# Altium schematic sheet inverter.SchDoc
size A3; SheetNumber: 3; SheetTotal: 7
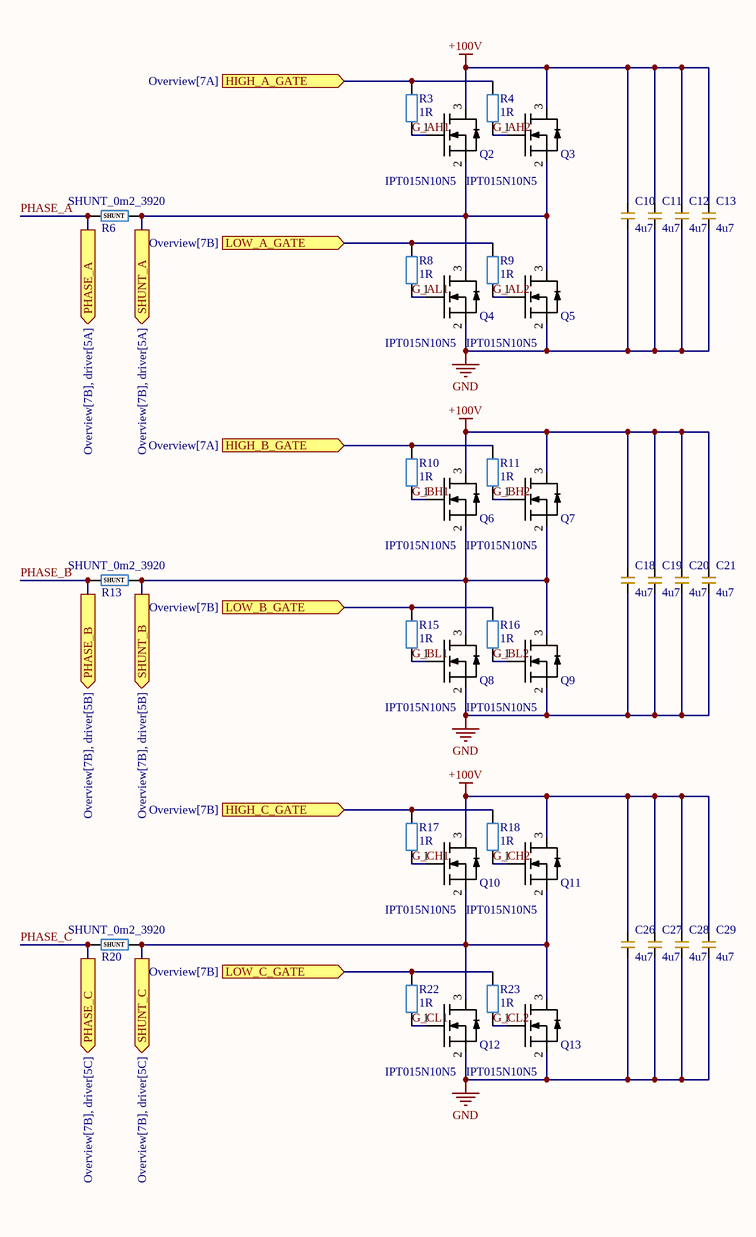
[diagram p0: inverter.SchDoc]

## Parts
C10  4u7  [FS32X475K101EGG]
C11  4u7  [FS32X475K101EGG]
C12  4u7  [FS32X475K101EGG]
C13  4u7  [FS32X475K101EGG]
C18  4u7  [FS32X475K101EGG]
C19  4u7  [FS32X475K101EGG]
C20  4u7  [FS32X475K101EGG]
C21  4u7  [FS32X475K101EGG]
C26  4u7  [FS32X475K101EGG]
C27  4u7  [FS32X475K101EGG]
C28  4u7  [FS32X475K101EGG]
C29  4u7  [FS32X475K101EGG]
Q2  IPT015N10N5  [IPT015N10N5]
Q3  IPT015N10N5  [IPT015N10N5]
Q4  IPT015N10N5  [IPT015N10N5]
Q5  IPT015N10N5  [IPT015N10N5]
Q6  IPT015N10N5  [IPT015N10N5]
Q7  IPT015N10N5  [IPT015N10N5]
Q8  IPT015N10N5  [IPT015N10N5]
Q9  IPT015N10N5  [IPT015N10N5]
Q10  IPT015N10N5  [IPT015N10N5]
Q11  IPT015N10N5  [IPT015N10N5]
Q12  IPT015N10N5  [IPT015N10N5]
Q13  IPT015N10N5  [IPT015N10N5]
R3  1R  [RES_0805]
R4  1R  [RES_0805]
R6  SHUNT_0m2_3920  [ASR-M-5-0.2F-t1]
R8  1R  [RES_0805]
R9  1R  [RES_0805]
R10  1R  [RES_0805]
R11  1R  [RES_0805]
R13  SHUNT_0m2_3920  [ASR-M-5-0.2F-t1]
R15  1R  [RES_0805]
R16  1R  [RES_0805]
R17  1R  [RES_0805]
R18  1R  [RES_0805]
R20  SHUNT_0m2_3920  [ASR-M-5-0.2F-t1]
R22  1R  [RES_0805]
R23  1R  [RES_0805]

## Ports
HIGH_A_GATE (in, see Overview[7A]), HIGH_B_GATE (in, see Overview[7A]), HIGH_C_GATE (in, see Overview[7B]), LOW_A_GATE (in, see Overview[7B]), LOW_B_GATE (in, see Overview[7B]), LOW_C_GATE (in, see Overview[7B]), PHASE_A (out, see Overview[7B], driver[5A]), PHASE_B (out, see Overview[7B], driver[5B]), PHASE_C (out, see Overview[7B], driver[5C]), SHUNT_A (out, see Overview[7B], driver[5A]), SHUNT_B (out, see Overview[7B], driver[5B]), SHUNT_C (out, see Overview[7B], driver[5C])

## Nets
+100V: C10.2 C11.2 C12.2 C13.2 C18.2 C19.2 C20.2 C21.2 C26.2 C27.2 C28.2 C29.2 Q2.3 Q3.3 Q6.3 Q7.3 Q10.3 Q11.3
GND: C10.1 C11.1 C12.1 C13.1 C18.1 C19.1 C20.1 C21.1 C26.1 C27.1 C28.1 C29.1 Q4.2 Q5.2 Q8.2 Q9.2 Q12.2 Q13.2
G_AH1: Q2.1(G) R3.1
G_AH2: Q3.1(G) R4.1
G_AL1: Q4.1(G) R8.1
G_AL2: Q5.1(G) R9.1
G_BH1: Q6.1(G) R10.1
G_BH2: Q7.1(G) R11.1
G_BL1: Q8.1(G) R15.1
G_BL2: Q9.1(G) R16.1
G_CH1: Q10.1(G) R17.1
G_CH2: Q11.1(G) R18.1
G_CL1: Q12.1(G) R22.1
G_CL2: Q13.1(G) R23.1
HIGH_A_GATE: R3.2 R4.2 ; port HIGH_A_GATE
HIGH_B_GATE: R10.2 R11.2 ; port HIGH_B_GATE
HIGH_C_GATE: R17.2 R18.2 ; port HIGH_C_GATE
LOW_A_GATE: R8.2 R9.2 ; port LOW_A_GATE
LOW_B_GATE: R15.2 R16.2 ; port LOW_B_GATE
LOW_C_GATE: R22.2 R23.2 ; port LOW_C_GATE
PHASE_A: R6.1 ; port PHASE_A
PHASE_B: R13.1 ; port PHASE_B
PHASE_C: R20.1 ; port PHASE_C
SHUNT_A: Q2.2 Q3.2 Q4.3 Q5.3 R6.2 ; port SHUNT_A
SHUNT_B: Q6.2 Q7.2 Q8.3 Q9.3 R13.2 ; port SHUNT_B
SHUNT_C: Q10.2 Q11.2 Q12.3 Q13.3 R20.2 ; port SHUNT_C

## Notes on the sheet
- (in symbol SHUNT_0m2_3920) SHUNT

## Library data of the parts
C10-C13 C18-C21 C26-C29 = 4u7: 100V 4.7uF X7R ±10% 1210 Multilayer Ceramic Capacitors MLCC - SMD/SMT ROHS; Mfr.: PSA(Prosperity Dielectrics); Voltage Rating: 100V; Package: 1210; LCSC: C381466; Mfr. Part: FS32X475K101EGG
Q2-Q13 = IPT015N10N5: 100V 500A 533W 1.35mΩ 1 N-channel HSOF-8 MOSFETs ROHS; Mfr.: Tokmas; LCSC: C19626223; Mfr. Part: IPT015N10N5
R3 R4 R8-R11 R15-R18 R22 R23 = RES_0805: Resistor SMD 0805 Generic; Mfr.: *; Voltage Rating: *; Mfr. Part: *; Package: 0805; LCSC: *; Power Rating: *
R6 R13 R20 = SHUNT_0m2_3920: 12W 0.2mΩ Patch Splitter ±200ppm/℃ ±1% 3920 Current Sense Resistors / Shunt Resistors ROHS; Mfr.: Shenzhen Yezhan Elec.; Mfr. Part: ASR-M-5-0.2F-t1; LCSC: C469432